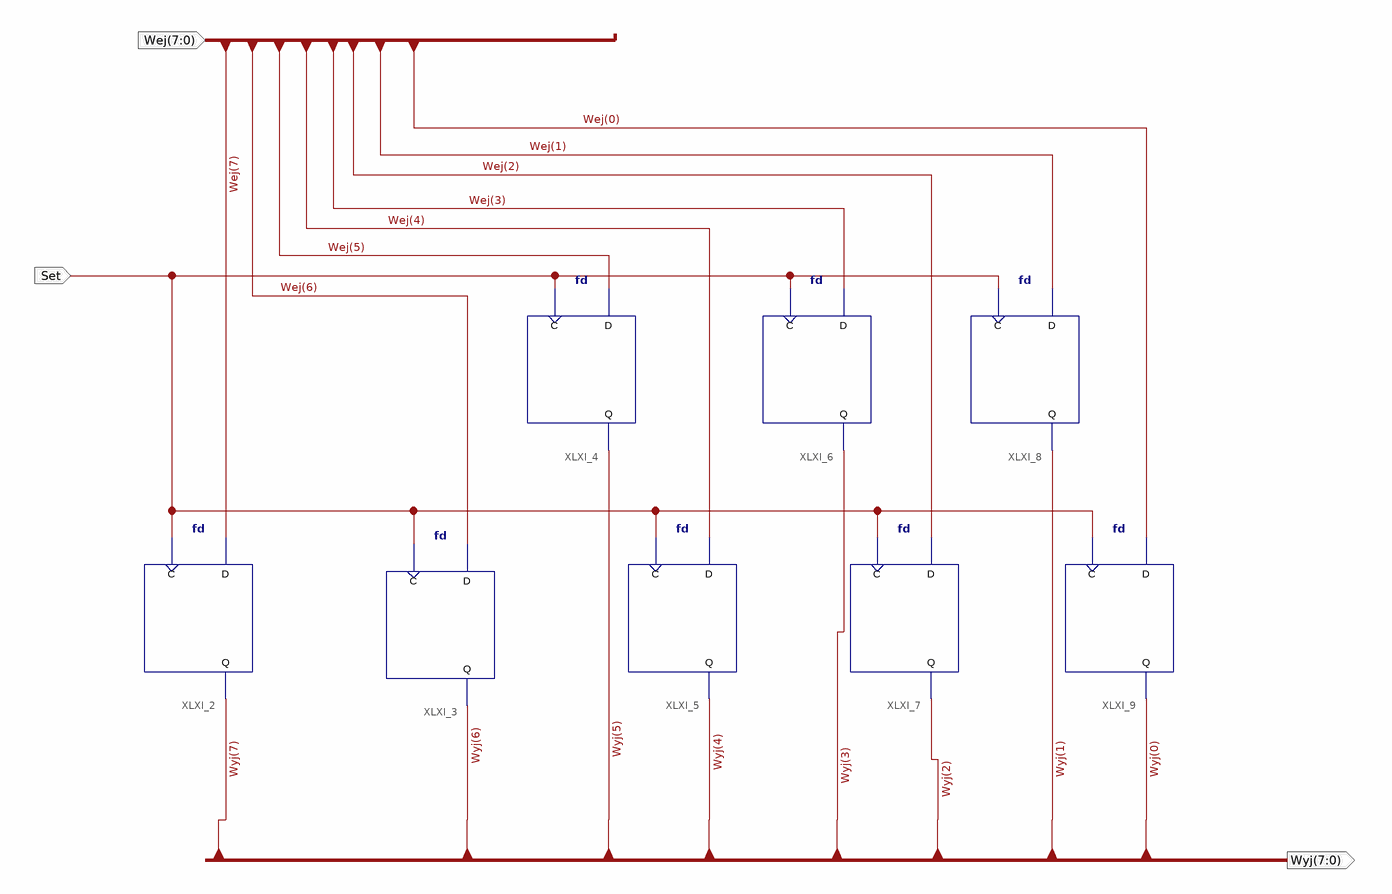
[diagram p0: schematic sheet 1]
// Xilinx ISE schematic Register8Bit.sch (aspartan6) as structural Verilog: 8 symbols, 3 ports
module Register8Bit (
  input  [7:0] Wej,
  input  Set,
  output [7:0] Wyj
);

  fd XLXI_8 (.C(Set), .D(Wej[1]), .Q(Wyj[1]));
  fd XLXI_6 (.C(Set), .D(Wej[3]), .Q(Wyj[3]));
  fd XLXI_4 (.C(Set), .D(Wej[5]), .Q(Wyj[5]));
  fd XLXI_9 (.C(Set), .D(Wej[0]), .Q(Wyj[0]));
  fd XLXI_7 (.C(Set), .D(Wej[2]), .Q(Wyj[2]));
  fd XLXI_5 (.C(Set), .D(Wej[4]), .Q(Wyj[4]));
  fd XLXI_3 (.C(Set), .D(Wej[6]), .Q(Wyj[6]));
  fd XLXI_2 (.C(Set), .D(Wej[7]), .Q(Wyj[7]));
endmodule
